# Altium schematic sheet FT232RL_Programmer.SchDoc
size A4
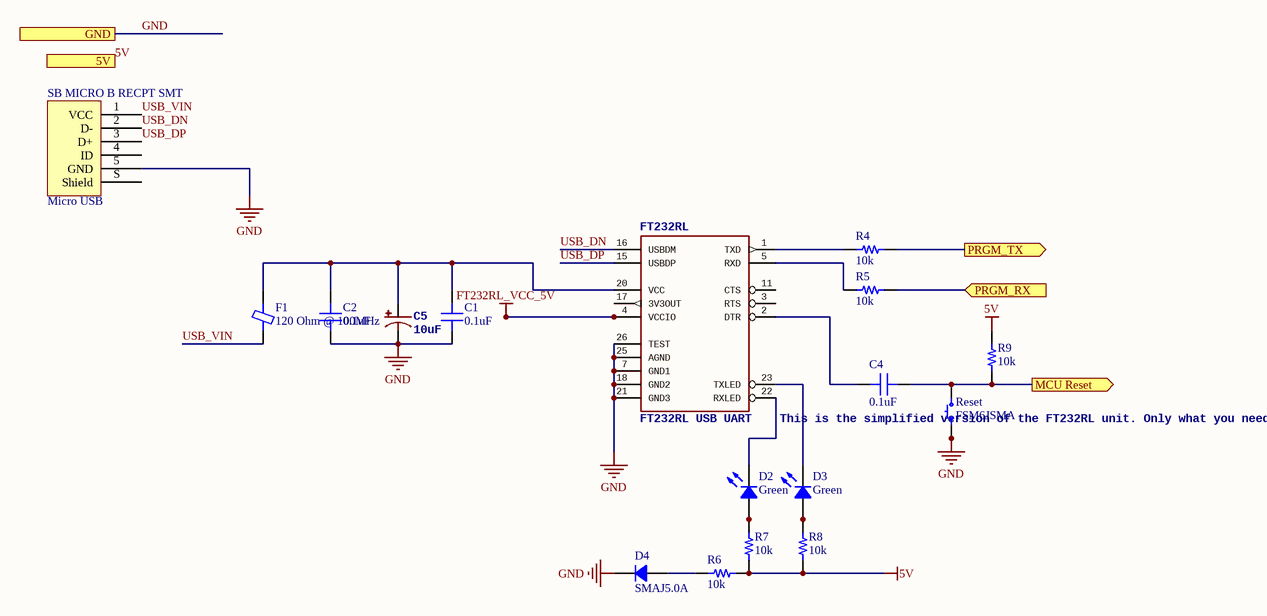
[diagram p0: FT232RL_Programmer.SchDoc]

## Parts
C1  0.1uF  [CAP 0402/1005]
C2  0.1uF  [CAP 0402/1005]
C4  0.1uF  [CAP 0402/1005]
C5  10uF  [CPOL-RADIAL-5MM-10MM-KIT]
D2  Green  [LED 0603/1608 GREEN]
D3  Green  [LED 0603/1608 GREEN]
D4  SMAJ5.0A  [DO214AC SMA]
F1  120 Ohm @ 100MHz  [FER 0201/0603]
FT232RL  FT232RL USB UART    This is the simplified version of the FT232RL unit. Only what you need, nothing you don't.   FT232RL 4th Generation USB UART (USB <-> Serial) Controller.   Datasheet SparkFun Products  Component (COM-00650)  SparkFun RedBot Mainboard (ROB-12097)  SparkFun FTDI Basic Breakout - 5V (DEV-09716)  SparkFun FTDI Basic Breakout - 3.3V (DEV-09873)  Bus Pirate - v3.6a (TOL-12942)  SparkFun USB to Serial Breakout - FT232RL (BOB-12731)  SparkFun PicoBoard (WIG-11888)  SparkFun RFID USB Reader (SEN-09963)  LilyPad FTDI Basic Breakout - 5V (DEV-10275)  SparkFun Stepoko (ROB-13899)  [SSOP28DB]
R4  10k  [RES 0402/1005]
R5  10k  [RES 0402/1005]
R6  10k  [RES 0402/1005]
R7  10k  [RES 0402/1005]
R8  10k  [RES 0402/1005]
R9  10k  [RES 0402/1005]
Reset  FSM6JSMA  [TE FSM6JSMA]
SB_MICRO_B_RECPT_SMT  Micro USB  [FCI USB 10118193-0001LF]

## Ports
5V, GND, MCU Reset (out), PRGM_RX (in), PRGM_TX (out)

## Nets
5V: R6.1 R7.1 R8.1 R9.2 ; port 5V
FT232RL_VCC_5V: FT232RL.4(VCCIO)
GND: C1.1 C2.1 C5.- D4.2 FT232RL.7(GND1) FT232RL.18(GND2) FT232RL.21(GND3) FT232RL.25(AGND) FT232RL.26(TEST) Reset.1 Reset.2 SB_MICRO_B_RECPT_SMT.5(GND) ; port GND
MCU Reset: C4.2 R9.1 Reset.3 Reset.4 ; port MCU Reset
PRGM_RX: R5.2 ; port PRGM_RX
PRGM_TX: R4.2 ; port PRGM_TX
USB_DN: FT232RL.16(USBDM) SB_MICRO_B_RECPT_SMT.2(D-)
USB_DP: FT232RL.15(USBDP) SB_MICRO_B_RECPT_SMT.3(D+)
USB_VIN: F1.1 SB_MICRO_B_RECPT_SMT.1(VCC)
NetC1_2: C1.2 C2.2 C5.+ F1.2 FT232RL.20(VCC)
NetC4_1: C4.1 FT232RL.2(DTR)
NetD2_1: D2.1 R7.2
NetD2_2: D2.2 FT232RL.22(RXLED)
NetD3_1: D3.1 R8.2
NetD3_2: D3.2 FT232RL.23(TXLED)
NetD4_1: D4.1 R6.2
NetFT232RL_1: FT232RL.1(TXD) R4.1
NetFT232RL_5: FT232RL.5(RXD) R5.1

Not connected (* = marked no-connect by the designer): FT232RL 3(RTS) 11(CTS) 17(3V3OUT); SB_MICRO_B_RECPT_SMT 4(ID) S(Shield)

## Notes on the sheet
- Title
- Size:
- Date:
- A4
- Number:
- Time:
- Revision:
- Sheet
- of
- File:

## Library data of the parts
C1 C2 C4 = C1005X7R1C104K050BC: CAP CER 0.1UF 16V X7R 0402; Manufacturer: TDK Corporation; TemperatureRange: -55C ~ 125C; Tolerance: 10%; Value: 0.1uF; Part Number: C1005X7R1C104K050BC; PartId: 3856; Supplier 1: Digi-Key; Supplier Part Number 1: 445-4952-2-ND; ComponentLink1Description: Datasheet; ComponentLink1URL: https://product.tdk.com/info/en/catalog/datasheets/mlcc_commercial_general_en.pdf; ComponentLink2Description: Digi-Key listing; ComponentLink2URL: http://digikey.com/product-detail/en/C1005X7R1C104K050BC/445-4952-2-ND/2093220; TemperatureCoefficient: X7R; Voltage: 16V; Price: 0.0066; Type: -; Device Package: 0402 (1005 Metric)
C5 = 1000UF-RADIAL-5MM-35V-20%-KIT: PROD_ID: CAP-09538
D2 D3 = LTST-C191KGKT: LED GREEN CLEAR 0603 SMD; Manufacturer: Lite-On Inc.; Type: Surface Mount; Millicandela: 35mcd; Voltage Forward: 2V; Current (Test): 20mA; Viewing Angle: 130; Value: Green; Part Number: LTST-C191KGKT; PartId: 7051; Supplier 1: Digi-Key; Supplier Part Number 1: 160-1446-2-ND; ComponentLink1Description: Datasheet; ComponentLink1URL: http://optoelectronics.liteon.com/upload/download/DS22-2000-228/S_110_LTST-C191KGKT.pdf; ComponentLink2Description: Digi-Key Listing; ComponentLink2URL: http://www.digikey.ca/product-detail/en/LTST-C191KGKT/160-1446-2-ND/386835; Price: 0.0521; Device Package: 0603 (1608 Metric); Colour: Green; Lens Transparency: Clear
D4 = SMAJ5.0A: TVS DIODE 5VWM 9.2VC SMA; Manufacturer: Littelfuse Inc.; Type: Surface Mount; Power - Peak Pulse: 400W; Current - Peak Pulse: 43.5A; Voltage (Clamping): 9.2V; Voltage (Breakdown): 6.4V; Voltage (Reverse Standoff): 5V; Part Number: SMAJ5.0A; PartId: 7757; Supplier 1: Digi-Key; Supplier Part Number 1: SMAJ5.0ALFTR-ND; ComponentLink1Description: Datasheet; ComponentLink1URL: http://www.littelfuse.com/~/media/electronics/datasheets/tvs_diodes/littelfuse_tvs_diode_smaj_datasheet.pdf.pdf; ComponentLink2Description: Digi-Key Listing; ComponentLink2URL: http://www.digikey.ca/product-detail/en/SMAJ5.0A/SMAJ5.0ALFTR-ND/762250; Operating Temperature: -55C ~ 150C (TJ); Price: 0.1626; Device Package: DO-214AC, SMA
F1 = BLM03AG121SN1D: FERRITE BEAD 120 OHM 0201 1LN; Manufacturer: Murata Electronics North America; DC Resistance: 500 mOhm; Current Rating: 200mA; Part Number: BLM03AG121SN1D; PartId: 20352; Value: 120 Ohm @ 100MHz; Supplier 1: Digi-Key; Supplier Part Number 1: 490-2557-2-ND; ComponentLink1Description: Datasheet; ComponentLink1URL: http://search.murata.co.jp/Ceramy/image/img/PDF/ENG/L0110S0100BLM03AG.pdf; ComponentLink2Description: Digi-Key Listing; ComponentLink2URL: https://www.digikey.com/product-detail/en/murata-electronics-north-america/BLM03AG121SN1D/490-2557-2-ND/610979; Price: 0.03; Device Package: 0201 (0603 Metric)
FT232RL = FT232RL-BASICSSOP: PROD_ID: IC-00870
R4-R9 = ERJ-2RKF1002X: RES SMD 10K OHM 1% 1/10W 0402; Manufacturer: Panasonic Electronic Components; TemperatureRange: -55C ~ 155C; TemperatureCoefficient: 100ppm/C; PowerRating: 0.1W, 1/10W; Value: 10k; Part Number: ERJ-2RKF1002X; PartId: 1; Supplier 1: Digi-Key; Supplier Part Number 1: P10.0KLTR-ND; ComponentLink1Description: Datasheet; ComponentLink1URL: http://industrial.panasonic.com/www-cgi/jvcr13pz.cgi?E+PZ+3+AOA0002+ERJ2RKF1002X+7+WW; ComponentLink2Description: Digikey listing; ComponentLink2URL: http://digikey.com/product-detail/en/ERJ-2RKF1002X/P10.0KLTR-ND/192073; Tolerance: 1%; Price: 0.0043; Type: Thick Film; Device Package: 0402 (1005 Metric)
Reset = FSM6JSMA: SWITCH TACTILE SPST-NO 0.05A 24V; Manufacturer: TE Connectivity Alcoswitch Switches; Switch Function: Off-Mom; Contact Rating @ Voltage: 0.05A @ 24VDC; Actuator Type: Standard; Actuator Orientation: Top Actuated; Illumination: Non-Illuminated; Operating Force: 160gf; Switch Travel: 0.25mm; Mechanical Life: 100,000 Cycles; Part Number: FSM6JSMA; PartId: 7910; Supplier 1: Digi-Key; Supplier Part Number 1: 450-1133-ND; ComponentLink1Description: Datasheet; ComponentLink1URL: http://www.te.com/commerce/DocumentDelivery/DDEController?Action=srchrtrv&DocNm=2-1437565-7&DocType=Customer+Drawing&DocLang=English; ComponentLink2Description: Digi-Key Listing; ComponentLink2URL: http://www.digikey.com/product-detail/en/FSM6JSMA/450-1133-ND/525822; Price: 0.24; Circuit: SPST-NO; Illumination Voltage: -; Illumination Type, Colour: -; Operating Temperature: -35C ~ 85C
SB_MICRO_B_RECPT_SMT = 10118193-0001LF: CONN USB MICRO B RECPT SMT R/A; Manufacturer: FCI; Number Of Positions: 5; Part Number: 10118193-0001LF; PartId: 7864; Supplier 1: Digi-Key; Supplier Part Number 1: 609-4616-2-ND; ComponentLink1Description: Datasheet; ComponentLink1URL: http://portal.fciconnect.com/Comergent//fci/drawing/10118193.pdf; ComponentLink2Description: Digi-Key Listing; ComponentLink2URL: http://www.digikey.ca/product-detail/en/10118193-0001LF/609-4616-2-ND/2785388; Price: 0.2823; Type: USB - micro B; Series: USB 2.0